# Altium schematic sheet mt3608.SchDoc
size A4; SheetNumber: 3; SheetTotal: 3
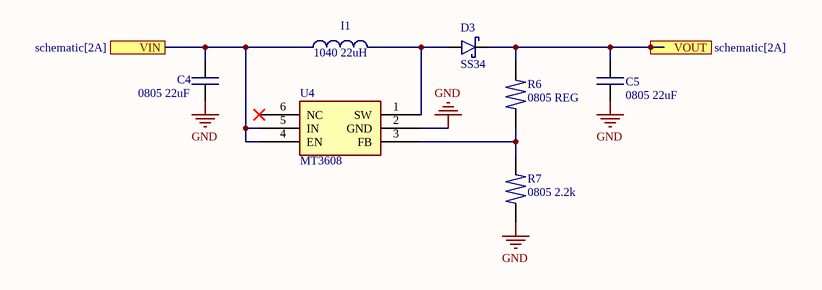
[diagram p0: mt3608.SchDoc]

## Parts
C4  0805 22uF  [CAPACITOR 0805]
C5  0805 22uF  [CAPACITOR 0805]
D3  SS34  [SS34]
I1  1040 22uH  [1040]
R6  0805 REG  [RESISTOR_0805]
R7  0805 2.2k  [RESISTOR_0805]
U4  MT3608  [MT3608]

## Ports
VIN (see schematic[2A]), VOUT (see schematic[2A])

## Nets
GND: C4.1 C5.1 R7.1 U4.2(GND)
VIN: C4.2 I1.1 U4.4(EN) U4.5(IN) ; port VIN
VOUT: C5.2 D3.2 R6.2 ; port VOUT
NetD3_1: D3.1 I1.2 U4.1(SW)
NetR6_1: R6.1 R7.2 U4.3(FB)

Not connected (* = marked no-connect by the designer): U4 6(NC)*

## Library data of the parts
C4 C5 = CAPACITOR 0805
D3 = SS34: Rectifier Schottky 40V 3A SMC; Mouser PN: 512-SS34; ComponentLink1Description: Datasheet; Digikey PN: SS34FSTR-ND
I1 = 1040
R6 R7 = RESISTOR_0805
U4 = MT3608: IC BUCK STEP UP 2A SOT23-6; ComponentLink1Description: Datasheet; ComponentLink1URL: https://www.olimex.com/Products/Breadboarding/BB-PWR-3608/resources/MT3608.pdf